# EAGLE board MSP-EXP430FR6989 (EAGLE 6.5.0), part 1 of 2
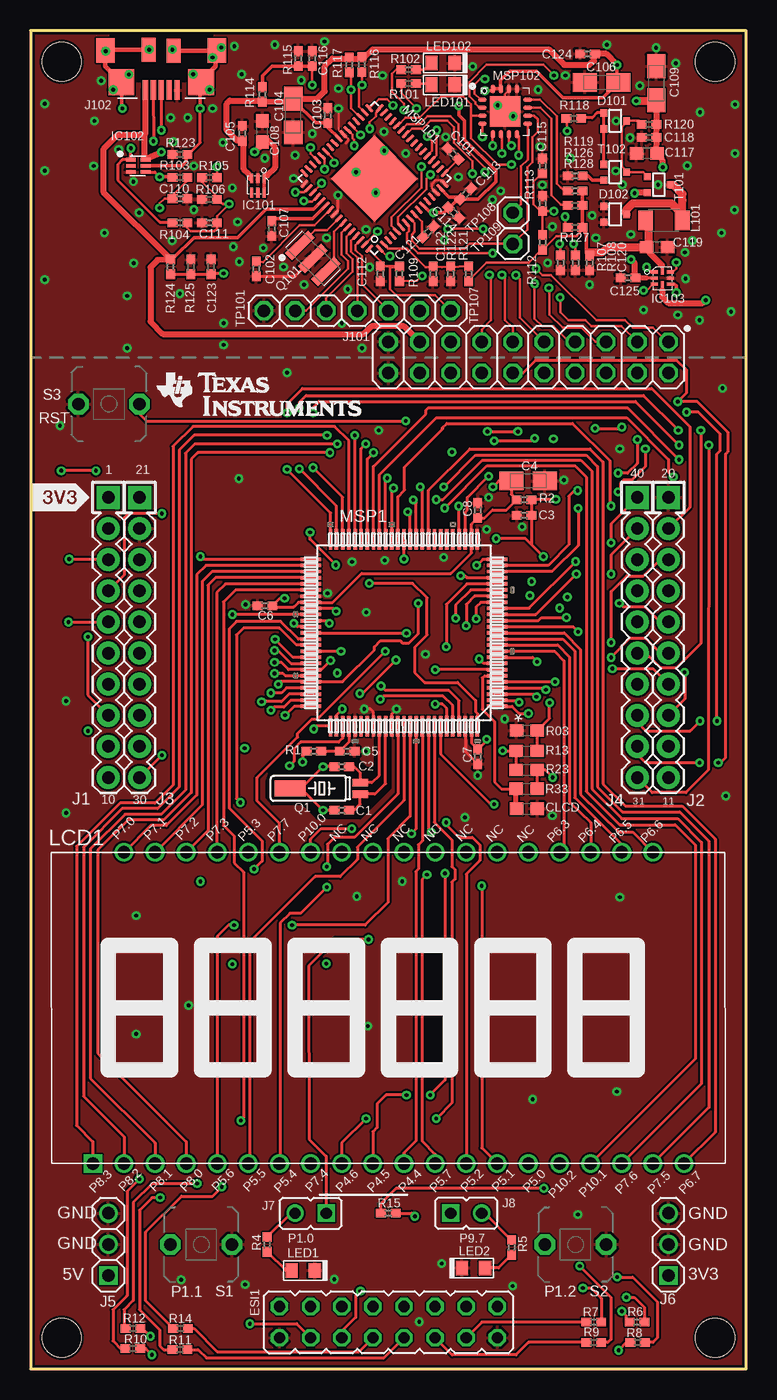
[diagram p6: board, top side]
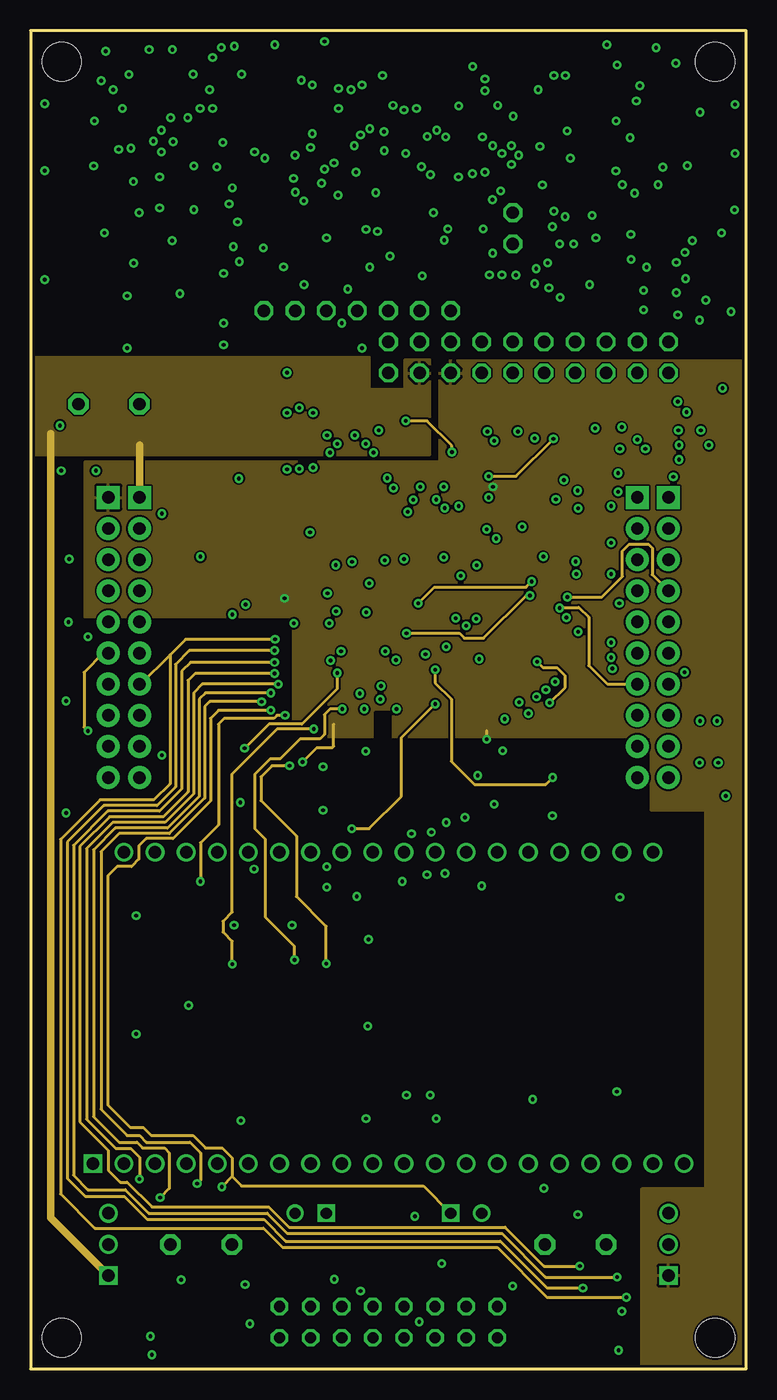
[diagram p7: board, inner layer Mid-Top]
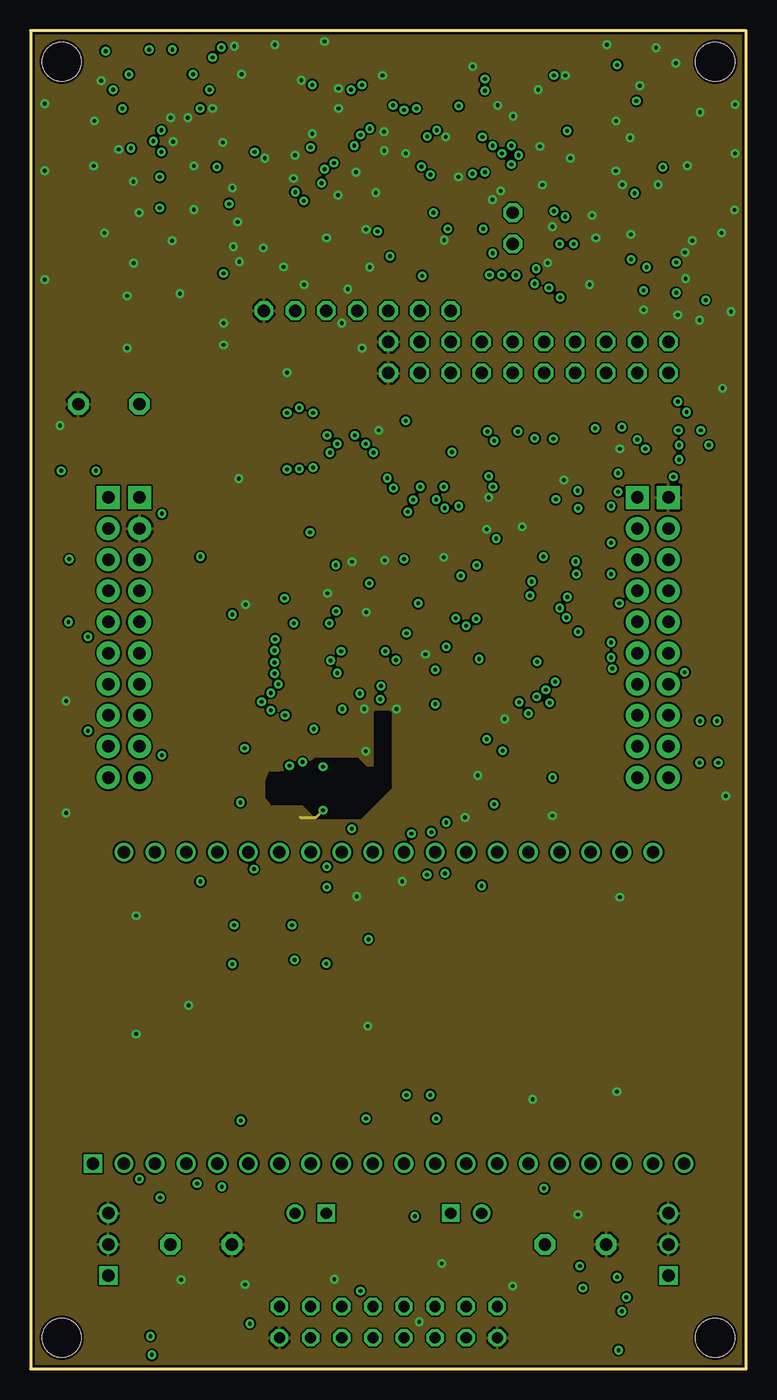
[diagram p8: board, inner layer Mid-Bottom]
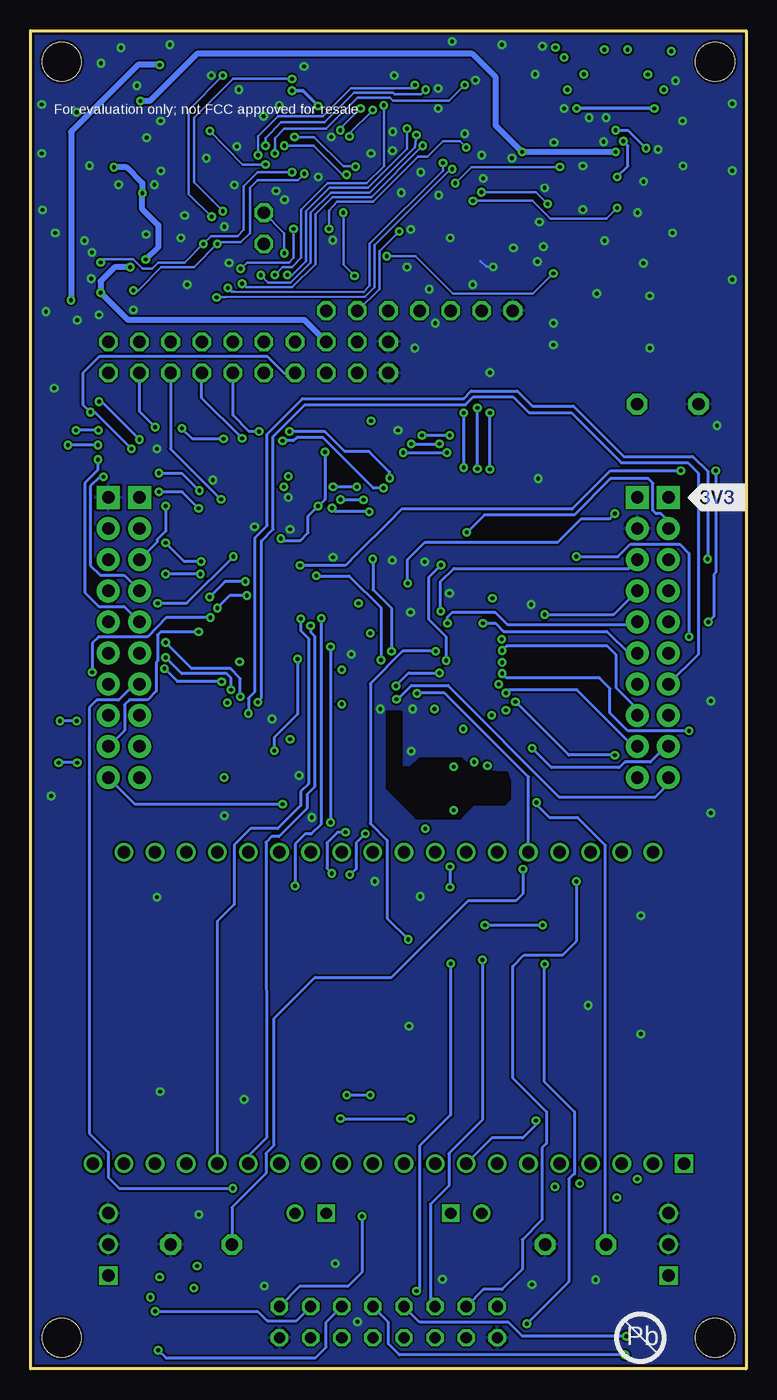
[diagram p9: board, bottom side, seen from below]

Size 58.42 x 109.22 mm. Coordinates in mm from the lower left corner, seen from the top.
Outline: 0,0 58.42,0 58.42,109.22 0,109.22 0,0
Copper layers (1+2*15+16): Top 0.0178mm / dielectric 12mil / Mid-Top 0.0356mm / dielectric 27mil / Mid-Bottom 0.0356mm / dielectric 12mil / Bottom 0.0178mm
Design rules "MSP430 PCBExpress 4-layer-dietmar": minimum track width 6mil, minimum drill 12mil, track to track 6mil, track to pad 6mil, pad to pad 6mil, via to via 8mil, smd to smd 6mil, copper to edge 8mil, drill to drill 8mil, minimum pad ring 10mil, minimum via ring 8mil, stop-mask expansion 8mil, vias tented up to drill 15mil, thermal gap 8mil
Net classes: 2 Power: width 0.203 mm, drill 0.305 mm, clearance 0.152 mm to class 0, clearance 0.152 mm to class 1, clearance 0.152 mm

## Footprints (pad centres in the part's own frame; a part is rotated, then mirrored left to right if it is on the bottom)
0402 = smd 0.8 x 0.7: 1 -0.6,0; 2 0.6,0
A/3216-18R = smd 1.95 x 1.5: + 1.375,0; - -1.375,0
C0603 = smd 1.1 x 1: 1 -0.85,0; 2 0.85,0
0603 = smd 1.1 x 1: 1 -0.85,0; 2 0.85,0
SOT323 = smd 0.6 x 0.55: 1 -0.65,-0.825; 2 0.65,-0.825; 3 0,1.025
JP8Q = drill 0.914 octagon: 1 -8.89,-1.27; 2 -8.89,1.27; 3 -6.35,-1.27; 4 -6.35,1.27; 5 -3.81,-1.27; 6 -3.81,1.27; 7 -1.27,-1.27; 8 -1.27,1.27; 9 1.27,-1.27; 10 1.27,1.27; 11 3.81,-1.27; 12 3.81,1.27; 13 6.35,-1.27; 14 6.35,1.27; 15 8.89,-1.27; 16 8.89,1.27
WSON_DSE = smd 0.25 x 0.8: 1 0,0; 2 0.5,0; 3 1,0; 5 0.5,1.15; 6 0,1.15; P4 1,1.15
SON(DRY)6 = smd 0.81 x 0.305: 1 -0.1,0; 2 -0.1,-0.5; 3 -0.1,-1; 4 1.1,-1; 5 1.1,-0.5; 6 1.1,0
UQFN_RSE = smd 0.25 x 0.58: 1 -0.5,-0.65; 2 0,-0.65; 3 0.5,-0.65; 5 0.5,0.65; 6 0,0.65; 7 -0.5,0.65 | smd 0.58 x 0.25: 4 0.55,0; 8 -0.55,0
1X10 = drill 1.016 pad 1.88 square: 1 0,10.16 | drill 1.016 pad 1.88: 2 0,7.62; 3 0,5.08; 4 0,2.54; 5 0,0; 6 0,-2.54; 7 0,-5.08; 8 0,-7.62; 9 0,-10.16; 10 0,-12.7
1X10-J2 = drill 1.016 pad 1.88: 11 0,-12.7; 12 0,-10.16; 13 0,-7.62; 14 0,-5.08; 15 0,-2.54; 16 0,0; 17 0,2.54; 18 0,5.08; 19 0,7.62 | drill 1.016 pad 1.88 square: 20 0,10.16
1X10-J3 = drill 1.016 pad 1.88 square: 21 0,10.16 | drill 1.016 pad 1.88: 22 0,7.62; 23 0,5.08; 24 0,2.54; 25 0,0; 26 0,-2.54; 27 0,-5.08; 28 0,-7.62; 29 0,-10.16; 30 0,-12.7
1X10-J4 = drill 1.016 pad 1.88: 31 0,-12.7; 32 0,-10.16; 33 0,-7.62; 34 0,-5.08; 35 0,-2.54; 36 0,0; 37 0,2.54; 38 0,5.08; 39 0,7.62 | drill 1.016 pad 1.88 square: 40 0,10.16
PINHEADER1X3 = drill 1.016 square: 1 -2.54,0 | drill 1.016: 2 0,0; 3 2.54,0
JUMPER-2.54 = drill 0.914 square: 1 0,-1.27 | drill 0.914: 2 0,1.27
2X10 = drill 1.016 octagon: 1 -11.43,-1.27; 2 -11.43,1.27; 3 -8.89,-1.27; 4 -8.89,1.27; 5 -6.35,-1.27; 6 -6.35,1.27; 7 -3.81,-1.27; 8 -3.81,1.27; 9 -1.27,-1.27; 10 -1.27,1.27; 11 1.27,-1.27; 12 1.27,1.27; 13 3.81,-1.27; 14 3.81,1.27; 15 6.35,-1.27; 16 6.35,1.27; 17 8.89,-1.27; 18 8.89,1.27; 19 11.43,-1.27; 20 11.43,1.27
EZFET_UX62M-B-5P = smd 0.42 x 1.6: 1 1.3,1.3; 2 0.65,1.3; 3 0,1.3; 4 -0.65,1.3; 5 -1.3,1.3 | smd 2.1 x 2.1: S1 -3.25,0.65; S2 3.25,0.65 | smd 1.5 x 2: S3 -4.55,-1.95; S4 4.55,-1.95 | smd 1.144 x 1.949: S5 -1.016,-1.93; S6 1.016,-1.981
L3216C = smd 1.2 x 1.6: 1 -1.5,0; 2 1.5,0
FH1138P = drill 1.016 square: 1 -22.86,0 | drill 1.016: 2 -20.32,0; 3 -17.78,0; 4 -15.24,0; 5 -12.7,0; 6 -10.16,0; 7 -7.62,0; 8 -5.08,0; 9 -2.54,0; 10 0,0; 11 2.54,0; 12 5.08,0; 13 7.62,0; 14 10.16,0; 15 12.7,0; 16 15.24,0; 17 17.78,0; 18 20.32,0; 19 22.86,0; 20 25.4,0; 21 22.86,25.4; 22 20.32,25.4; 23 17.78,25.4; 24 15.24,25.4; 25 12.7,25.4; 26 10.16,25.4; 27 7.62,25.4; 28 5.08,25.4; 29 2.54,25.4; 30 0,25.4; 31 -2.54,25.4; 32 -5.08,25.4; 33 -7.62,25.4; 34 -10.16,25.4; 35 -12.7,25.4; 36 -15.24,25.4; 37 -17.78,25.4; 38 -20.32,25.4
LED0805 = smd 1 x 1.2: A 1.052,0.102; C -0.848,0.102
PZ100 = smd 1.676 x 0.279: 1 -7.62,5.994; 2 -7.62,5.512; 3 -7.62,5.004; 4 -7.62,4.496; 5 -7.62,3.988; 6 -7.62,3.505; 7 -7.62,2.997; 8 -7.62,2.489; 9 -7.62,2.007; 10 -7.62,1.499; 11 -7.62,0.991; 12 -7.62,0.508; 13 -7.62,0; 14 -7.62,-0.508; 15 -7.62,-0.991; 16 -7.62,-1.499; 17 -7.62,-2.007; 18 -7.62,-2.489; 19 -7.62,-2.997; 20 -7.62,-3.505; 21 -7.62,-3.988; 22 -7.62,-4.496; 23 -7.62,-5.004; 24 -7.62,-5.512; 25 -7.62,-5.994; 51 7.62,-5.994; 52 7.62,-5.512; 53 7.62,-5.004; 54 7.62,-4.496; 55 7.62,-3.988; 56 7.62,-3.505; 57 7.62,-2.997; 58 7.62,-2.489; 59 7.62,-2.007; 60 7.62,-1.499; 61 7.62,-0.991; 62 7.62,-0.508; 63 7.62,0; 64 7.62,0.508; 65 7.62,0.991; 66 7.62,1.499; 67 7.62,2.007; 68 7.62,2.489; 69 7.62,2.997; 70 7.62,3.505; 71 7.62,3.988; 72 7.62,4.496; 73 7.62,5.004; 74 7.62,5.512; 75 7.62,5.994 | smd 0.279 x 1.676: 26 -5.994,-7.62; 27 -5.512,-7.62; 28 -5.004,-7.62; 29 -4.496,-7.62; 30 -3.988,-7.62; 31 -3.505,-7.62; 32 -2.997,-7.62; 33 -2.489,-7.62; 34 -2.007,-7.62; 35 -1.499,-7.62; 36 -0.991,-7.62; 37 -0.508,-7.62; 38 0,-7.62; 39 0.508,-7.62; 40 0.991,-7.62; 41 1.499,-7.62; 42 2.007,-7.62; 43 2.489,-7.62; 44 2.997,-7.62; 45 3.505,-7.62; 46 3.988,-7.62; 47 4.496,-7.62; 48 5.004,-7.62; 49 5.512,-7.62; 50 5.994,-7.62; 76 5.994,7.62; 77 5.512,7.62; 78 5.004,7.62; 79 4.496,7.62; 80 3.988,7.62; 81 3.505,7.62; 82 2.997,7.62; 83 2.489,7.62; 84 2.007,7.62; 85 1.499,7.62; 86 0.991,7.62; 87 0.508,7.62; 88 0,7.62; 89 -0.508,7.62; 90 -0.991,7.62; 91 -1.499,7.62; 92 -2.007,7.62; 93 -2.489,7.62; 94 -2.997,7.62; 95 -3.505,7.62; 96 -3.988,7.62; 97 -4.496,7.62; 98 -5.004,7.62; 99 -5.512,7.62; 100 -5.994,7.62
RGC64 = smd 0.825 x 0.28: 1 -4.36,3.75; 2 -4.36,3.25; 3 -4.36,2.75; 4 -4.36,2.25; 5 -4.36,1.75; 6 -4.36,1.25; 7 -4.36,0.75; 8 -4.36,0.25; 9 -4.36,-0.25; 10 -4.36,-0.75; 11 -4.36,-1.25; 12 -4.36,-1.75; 13 -4.36,-2.25; 14 -4.36,-2.75; 15 -4.36,-3.25; 16 -4.36,-3.75; 33 4.36,-3.75; 34 4.36,-3.25; 35 4.36,-2.75; 36 4.36,-2.25; 37 4.36,-1.75; 38 4.36,-1.25; 39 4.36,-0.75; 40 4.36,-0.25; 41 4.36,0.25; 42 4.36,0.75; 43 4.36,1.25; 44 4.36,1.75; 45 4.36,2.25; 46 4.36,2.75; 47 4.36,3.25; 48 4.36,3.75 | smd 0.28 x 0.825: 17 -3.75,-4.36; 18 -3.25,-4.36; 19 -2.75,-4.36; 20 -2.25,-4.36; 21 -1.75,-4.36; 22 -1.25,-4.36; 23 -0.75,-4.36; 24 -0.25,-4.36; 25 0.25,-4.36; 26 0.75,-4.36; 27 1.25,-4.36; 28 1.75,-4.36; 29 2.25,-4.36; 30 2.75,-4.36; 31 3.25,-4.36; 32 3.75,-4.36; 49 3.75,4.36; 50 3.25,4.36; 51 2.75,4.36; 52 2.25,4.36; 53 1.75,4.36; 54 1.25,4.36; 55 0.75,4.36; 56 0.25,4.36; 57 -0.25,4.36; 58 -0.75,4.36; 59 -1.25,4.36; 60 -1.75,4.36; 61 -2.25,4.36; 62 -2.75,4.36; 63 -3.25,4.36; 64 -3.75,4.36 | smd 5 x 5: TP 0,0
RSA16 = smd 0.7 x 0.35: 1 -1.85,0.975; 2 -1.85,0.325; 3 -1.85,-0.325; 4 -1.85,-0.975; 9 1.85,-0.975; 10 1.85,-0.325; 11 1.85,0.325; 12 1.85,0.975 | smd 0.35 x 0.7: 5 -0.975,-1.85; 6 -0.325,-1.85; 7 0.325,-1.85; 8 0.975,-1.85; 13 0.975,1.85; 14 0.325,1.85; 15 -0.325,1.85; 16 -0.975,1.85 | smd 2.5 x 2.5: TP 0,0
MS3V-T1R = smd 0.635 x 1.27: P1 -0.47,-4.43; P2 0.47,-4.43 | smd 1.27 x 2.54: P3 0,1.3
CSTCR4M = smd 0.8 x 2.6: 1 -1.5,0; 2 0,0; 3 1.5,0
PBTH = drill 1.016 pad 1.676 octagon: 1 -0.001,0.001; 2 5.001,0.001
1X01 = drill 1.016 octagon: 1 0,0
MOUNTHOLE_125MIL = hole 3.175: 0,0

## Placement (x,y rotation side)
C1  10p  [0402]  25.4,45.59 180 top
C2  10p  [0402]  25.4,49.15 180 top
C3  1n1  [0402]  40.28,69.65 180 top
C4  10u  [A/3216-18R]  40.61,72.47 180 top
C5  100n  [0402]  25.83,50.39 0 top
C6  100n  [0402]  19.13,62.28 180 top
C7  100n  [0402]  36.5,49.96 270 top
C8  100n  [0402]  36.5,70.05 90 top
C101  470n  [0402]  34.48,99.15 135 top
C102  220n  [0402]  18.42,89.79 270 top
C103  100n  [0402]  24.26,102.29 90 top
C104  10u  [A/3216-18R]  21.43,102.29 90 top
C105  100n  [0402]  17.27,100.84 90 top
C106  4.7u  [A/3216-18R]  46.61,105 0 top
C107  220n  [0402]  19.68,93.07 270 top
C108  1u  [C0603]  18.92,100.99 90 top
C109  4.7u  [A/3216-18R]  51.09,104.93 270 top
C110  10p  [0402]  12.19,95.5 0 top
C111  10p  [0402]  14.6,93.54 180 top
C112  1n  [0402]  28.56,89.38 270 top
C113  100n  [0402]  35.53,95.89 45 top
C114  100n  [0402]  34.54,94.36 315 top
C115  32p  [0402]  41.78,98.17 270 top
C116  32p  [0402]  22.99,106.93 270 top
C117  4.7u  [C0603]  50.31,99.19 180 top
C118  100n  [0402]  50.49,100.5 180 top
C119  4.7u  [C0603]  51.13,91.55 0 top
C120  100n  [0402]  45.62,90.27 270 top
C121  100n  [0402]  32.46,92.78 45 top
C122  32p  [0402]  32.85,89.38 90 top
C123  32p  [0402]  14.73,89.94 270 top
C124  100n  [0402]  45.47,107.31 180 top
C125  100n  [0402]  48.77,89.03 180 top
CLCD  4u7  [0603]  40.51,45.72 0 top
D101  BAS40-05  [SOT323]  47.62,101.85 270 top
D102  BAS40-05  [SOT323]  47.62,94.23 270 top
DRAW1  [LOGO-ROCKET-10X7MM-BRD]  3.83,89.42 65 top
DRAW3  [LOGO-ROCKET-10X7MM-BRD]  15.92,67.7 7 top
ESI1  DNP  [JP8Q]  29.21,3.81 0 top
IC101  [WSON_DSE]  19.05,97.16 180 top
IC102  TPD4E004DRYR  [SON(DRY)6]  8.29,98.68 0 top
IC103  TS5A21366RSER  [UQFN_RSE]  51.56,89.03 270 top
J1  [1X10]  6.35,60.96 0 top
J2  [1X10-J2]  52.07,60.96 0 top
J3  [1X10-J3]  8.89,60.96 0 top
J4  [1X10-J4]  49.53,60.96 0 top
J5  [PINHEADER1X3]  6.35,10.16 90 top
J6  [PINHEADER1X3]  52.07,10.16 90 top
J7  [JUMPER-2.54]  22.86,12.7 90 top
J8  [JUMPER-2.54]  35.56,12.7 270 top
J101  [2X10]  40.64,82.55 180 top
J102  Micro-USB  [EZFET_UX62M-B-5P]  10.67,105.66 180 top
L101  2u2  [L3216C]  51.71,93.72 180 top
LCD1  [FH1138P]  27.94,16.76 0 top
LED1  Red  [LED0805]  22.35,8.13 180 top
LED2  Green  [LED0805]  36.07,8.13 0 top
LED101  Red  [LED0805]  33.78,104.9 180 top
LED102  Green  [LED0805]  33.78,106.68 180 top
MSP1  MSP430FR6989_PZ100  [PZ100]  30.48,60.07 180 top
MSP101  MSP430F5528IRGC  [RGC64]  28.07,97.16 135 top
MSP102  MSP430G2452IRSA16R  [RSA16]  38.73,102.62 0 top
Q1  32.768kHz  [MS3V-T1R]  22.48,47.37 90 top
Q101  PIEZO_CSTCR4M00G15L99  [CSTCR4M]  23.06,90.64 315 top
R1  0R  [0402]  23.11,50.39 0 top
R2  470  [0402]  40.28,70.94 180 top
R03  DNP  [0603]  40.51,52.1 180 top
R4  470  [0402]  19.3,10.16 270 top
R5  390  [0402]  39.27,9.91 270 top
R6  0R  [0402]  49.5,3.81 0 top
R7  0R  [0402]  45.97,3.81 0 top
R8  0R  [0402]  49.56,2.16 0 top
R9  0R  [0402]  45.97,2.16 0 top
R10  0R  [0402]  8.33,1.65 180 top
R11  0R  [0402]  12.19,1.57 180 top
R12  0R  [0402]  8.36,3.3 180 top
R13  DNP  [0603]  40.49,50.42 0 top
R14  0R  [0402]  12.24,3.3 180 top
R15  0R  [0402]  29.21,12.7 180 top
R23  DNP  [0603]  40.49,48.87 180 top
R33  DNP  [0603]  40.49,47.35 0 top
R101  470  [0402]  30.86,104.9 180 top
R102  390  [0402]  30.86,106.03 180 top
R103  27  [0402]  12.19,97.25 0 top
R104  27  [0402]  12.19,93.54 0 top
R105  1k4  [0402]  14.6,97.22 0 top
R106  1M  [0402]  14.61,95.44 180 top
R107  47k  [0402]  43.25,90.27 270 top
R108  47k  [0402]  44.48,90.27 270 top
R109  47k  [0402]  30.11,89.38 270 top
R112  220k  [0402]  41.81,91.95 90 top
R113  220k  [0402]  41.79,95.1 90 top
R114  220k  [0402]  18.92,104.01 90 top
R115  220k  [0402]  21.84,106.93 90 top
R116  4k7  [0402]  27.04,106.44 270 top
R117  4k7  [0402]  26,106.44 270 top
R118  820  [0402]  44.34,102.04 180 top
R119  0  [0402]  44.47,97.37 180 top
R120  470  [0402]  50.48,101.56 180 top
R121  220k  [0402]  35.75,89.38 90 top
R122  220k  [0402]  34.29,89.38 270 top
R123  33k  [0402]  12.19,99.12 180 top
R124  240k  [0402]  11.43,89.94 270 top
R125  150k  [0402]  13.08,89.94 90 top
R126  2k2  [0402]  44.45,96.14 180 top
R127  3k3  [0402]  44.45,93.17 180 top
R128  6k8  [0402]  44.45,94.94 180 top
S1  [PBTH]  11.43,10.16 0 top
S2  [PBTH]  41.99,10.16 0 top
S3  [PBTH]  8.89,78.74 180 top
T101  DMG1013UW  [SOT323]  51.18,96.65 270 top
T102  BC850CW-115  [SOT323]  47.62,97.66 270 top
TP101  TEST_PIN2  [1X01]  19.05,86.36 0 top
TP102  TEST_PIN2  [1X01]  21.59,86.36 0 top
TP103  TEST_PIN2  [1X01]  24.13,86.36 0 top
TP104  TEST_PIN2  [1X01]  26.67,86.36 0 top
TP105  TEST_PIN2  [1X01]  29.21,86.36 0 top
TP106  TEST_PIN2  [1X01]  31.75,86.36 0 top
TP107  TEST_PIN2  [1X01]  34.29,86.36 0 top
TP108  TEST_PIN2  [1X01]  39.37,94.36 0 top
TP109  TEST_PIN2  [1X01]  39.37,91.82 0 top
U$1  FR6989_REARSILK_REV0_1  [FR6989_REARSILK_REV0_1]  0,0.13 0 top
U$2  MOUNTHOLE_125MIL  [MOUNTHOLE_125MIL]  2.54,2.54 0 top
U$3  MOUNTHOLE_125MIL  [MOUNTHOLE_125MIL]  2.54,106.68 0 top
U$4  [LOGO16_TPLACE]  10.22,77.61 0 top
U$5  MOUNTHOLE_125MIL  [MOUNTHOLE_125MIL]  55.88,2.54 0 top
U$6  MOUNTHOLE_125MIL  [MOUNTHOLE_125MIL]  55.88,106.68 0 top
U$7  SILK_3V3_TAG  [SILK_3V3_TAG]  0,69.98 0 top
U$8  ESIF  [ESIF]  24.26,6.48 0 top